# EAGLE design M401M (EAGLE 6.6.0)
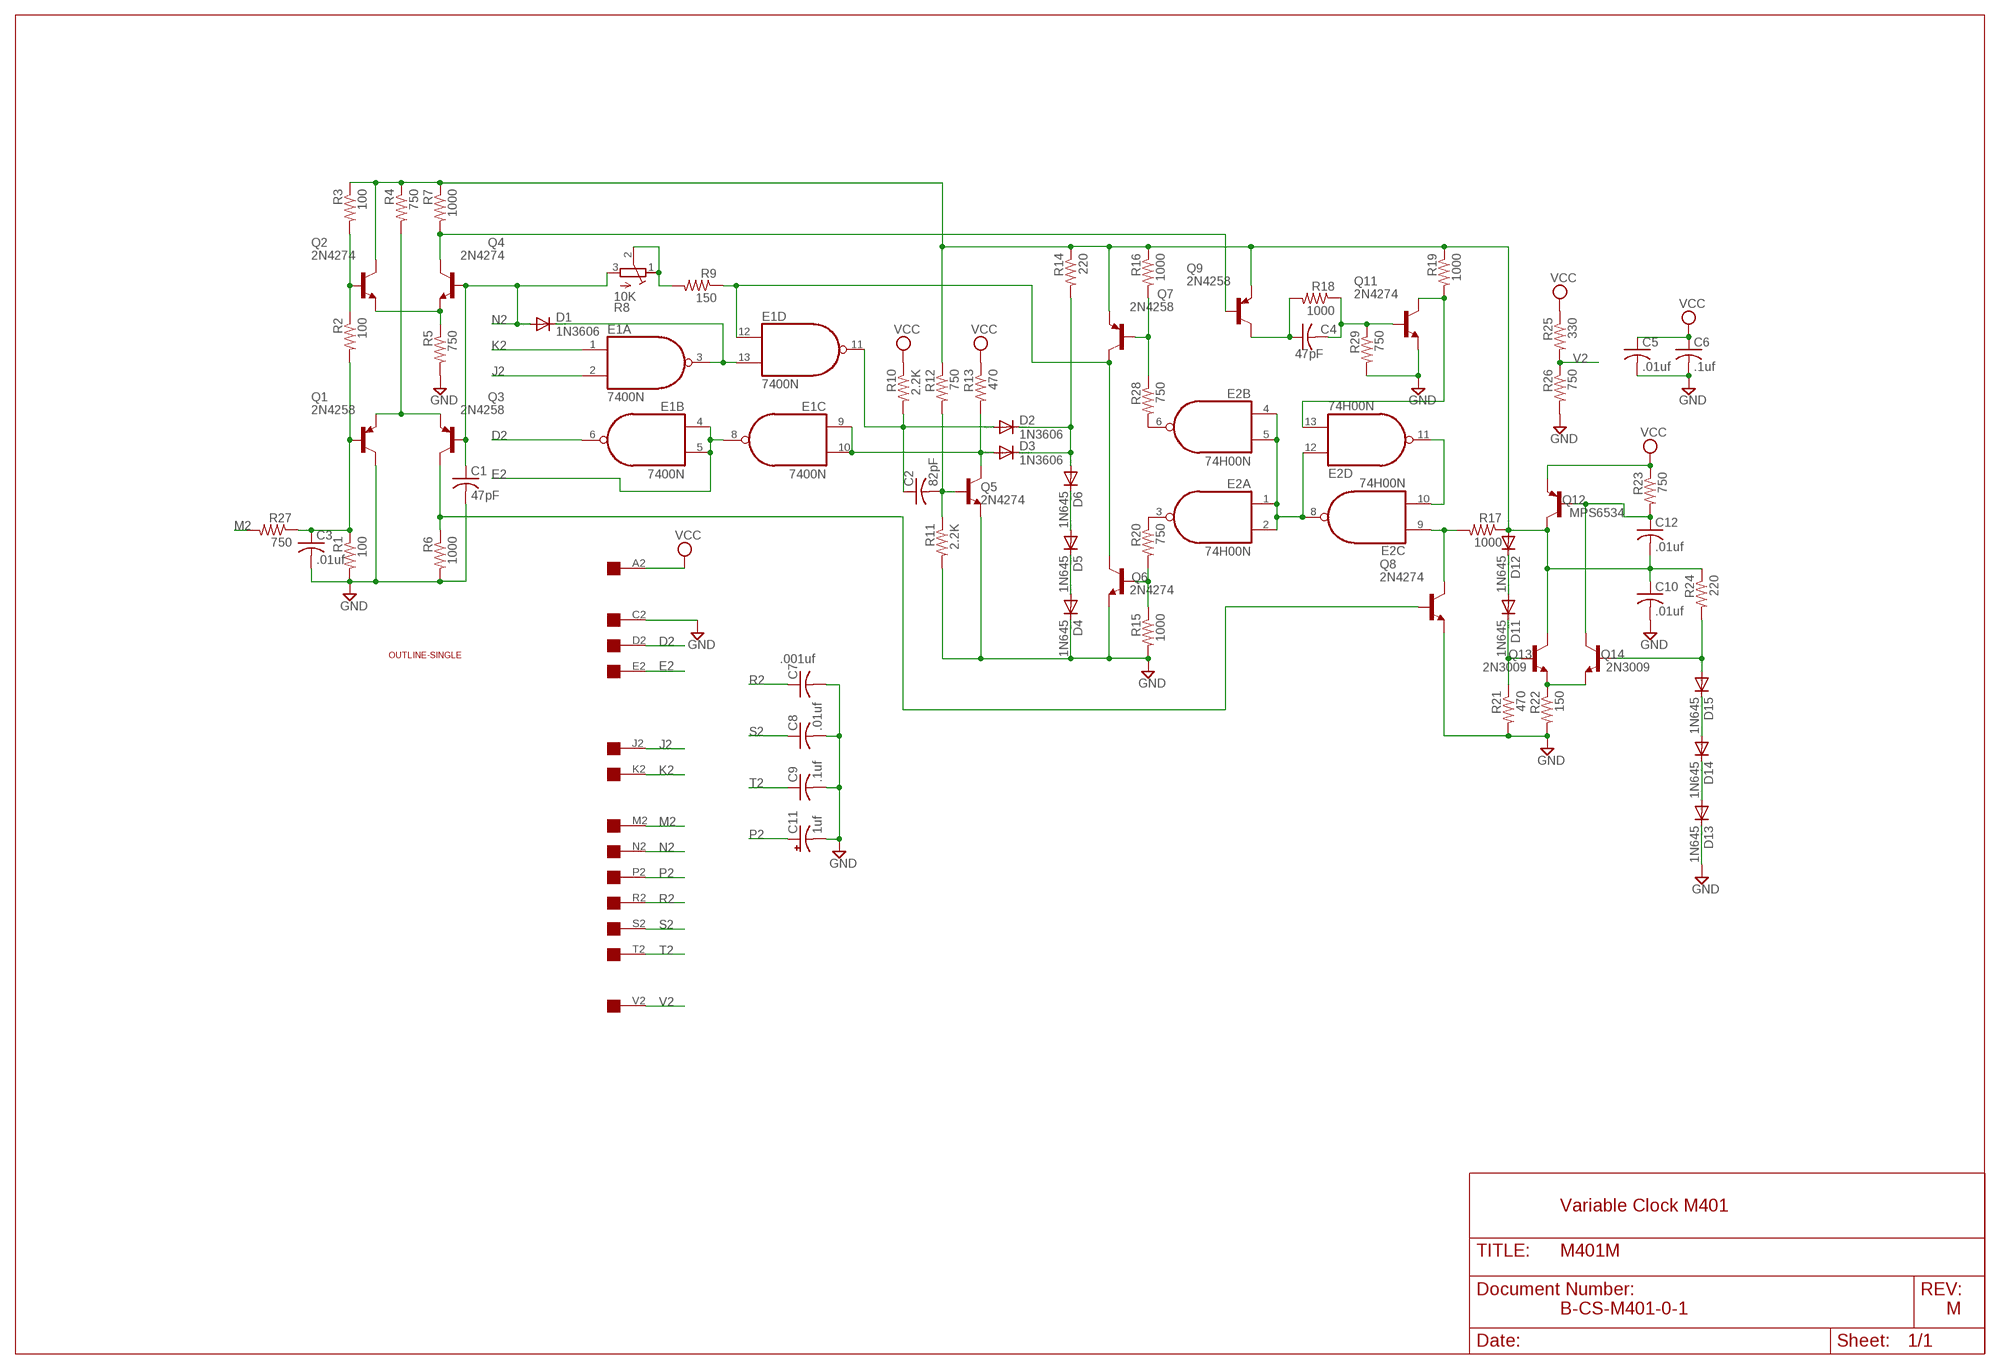
[diagram p0: schematic, sheet 1]

## Parts
C1  47pF  C-US050-025X075  [C050-025X075]
C2  82pF  C-US050-025X075  [C050-025X075]
C3  .01uf  C-US050-025X075  [C050-025X075]
C4  47pF  C-US050-025X075  [C050-025X075]
C5  .01uf  C-US050-025X075  [C050-025X075]
C6  .1uf  C-US102-043X133  [C102-043X133]
C7  .001uf  C-US050-025X075  [C050-025X075]
C8  .01uf  C-US225-062X268  [C225-062X268]
C9  .1uf  C-US275-093X316  [C275-093X316]
C10  .01uf  C-US050-025X075  [C050-025X075]
C11  1uf  CPOL-USE15-5AXIAL  [E15-5]
C12  .01uf  C-US050-025X075  [C050-025X075]
D1  1N3606  1N4148DO35-10  [DO35-10]
D2  1N3606  1N4148DO35-10  [DO35-10]
D3  1N3606  1N4148DO35-10  [DO35-10]
D4  1N645  1N4148DO35-10  [DO35-10]
D5  1N645  1N4148DO35-10  [DO35-10]
D6  1N645  1N4148DO35-10  [DO35-10]
D11  1N645  1N4148DO35-10  [DO35-10]
D12  1N645  1N4148DO35-10  [DO35-10]
D13  1N645  1N4148DO35-10  [DO35-10]
D14  1N645  1N4148DO35-10  [DO35-10]
D15  1N645  1N4148DO35-10  [DO35-10]
E1  7400N  [DIL14]
E2  74H00N  7400N  [DIL14]
Q1  2N4258  2N3637-PNP-TO39-EBC  [TO39]
Q2  2N4274  2N3019-NPN-TO39-EBC  [TO39]
Q3  2N4258  2N3637-PNP-TO39-EBC  [TO39]
Q4  2N4274  2N3019-NPN-TO39-EBC  [TO39]
Q5  2N4274  2N3019-NPN-TO39-EBC  [TO39]
Q6  2N4274  2N3019-NPN-TO39-EBC  [TO39]
Q7  2N4258  2N3637-PNP-TO39-EBC  [TO39]
Q8  2N4274  2N3019-NPN-TO39-EBC  [TO39]
Q9  2N4258  2N3637-PNP-TO39-EBC  [TO39]
Q11  2N4274  2N3019-NPN-TO39-EBC  [TO39]
Q12  MPS6534  2N3637-PNP-TO39-EBC  [TO39]
Q13  2N3009  2N3019-NPN-TO39-EBC  [TO39]
Q14  2N3009  2N3019-NPN-TO39-EBC  [TO39]
R1  100  R-US_0207/10  [0207/10]
R2  100  R-US_0207/10  [0207/10]
R3  100  R-US_0207/10  [0207/10]
R4  750  R-US_0207/10  [0207/10]
R5  750  R-US_0207/10  [0207/10]
R6  1000  R-US_0207/10  [0207/10]
R7  1000  R-US_0207/10  [0207/10]
R8  10K  275P  [3006Y]
R9  150  R-US_0207/10  [0207/10]
R10  2.2K  R-US_0207/10  [0207/10]
R11  2.2K  R-US_0207/10  [0207/10]
R12  750  R-US_0207/10  [0207/10]
R13  470  R-US_0207/10  [0207/10]
R14  220  R-US_0207/10  [0207/10]
R15  1000  R-US_0207/10  [0207/10]
R16  1000  R-US_0207/10  [0207/10]
R17  1000  R-US_0207/10  [0207/10]
R18  1000  R-US_0207/10  [0207/10]
R19  1000  R-US_0207/10  [0207/10]
R20  750  R-US_0207/10  [0207/10]
R21  470  R-US_0207/10  [0207/10]
R22  150  R-US_0207/10  [0207/10]
R23  750  R-US_0207/10  [0207/10]
R24  220  R-US_0207/10  [0207/10]
R25  330  R-US_0207/10  [0207/10]
R26  750  R-US_0207/10  [0207/10]
R27  750  R-US_0207/10  [0207/10]
R28  750  R-US_0207/10  [0207/10]
R29  750  R-US_0207/10  [0207/10]
U$1  OUTLINE-SINGLE  [SINGLE]
U$2  EDGE-1  [EDGE-CON1]

## Nets
D2: E1.6(B:O) U$2.D2
E2: E1.4(B:I0) E1.5(B:I1) E1.8(C:O) U$2.E2
GND [power]: C1.2 C3.2 C5.2 C6.2 C7.2 C8.2 C9.2 C10.2 C11.- D4.C D13.C Q1.3(C) Q5.1(E) Q6.1(E) Q8.1(E) Q11.1(E) R1.2 R5.2 R6.2 R11.2 R15.2 R21.2 R22.2 R26.2 R29.2 U$2.C2
J2: E1.2(A:I1) U$2.J2
K2: E1.1(A:I0) U$2.K2
M2: R27.2 U$2.M2
N2: C1.1 D1.A Q3.2(B) Q4.2(B) R8.3(E) U$2.N2
N$1: D14.A D15.C
N$2: D13.A D14.C
N$3: D15.A Q14.2(B) R24.2
N$4: C12.1 Q12.2(B) Q14.3(C) R23.2
N$5: C10.1 C12.2 D12.A Q2.3(C) Q7.1(E) Q9.1(E) Q12.3(C) Q13.3(C) R3.1 R4.1 R7.1 R12.1 R14.1 R16.1 R17.1 R19.1 R24.1
N$6: D11.C Q13.2(B) R21.1
N$7: Q13.1(E) Q14.1(E) R22.1
N$8: D11.A D12.C
N$9: E2.1(A:I0) E2.2(A:I1) E2.4(B:I0) E2.5(B:I1) E2.8(C:O) E2.12(D:I0)
N$10: C3.1 Q1.2(B) R1.1 R2.2 R27.1
N$11: D3.A E1.9(C:I0) E1.10(C:I1) Q5.3(C) R13.2
N$12: D1.C E1.3(A:O) E1.13(D:I1)
N$13: D4.A D5.C
N$14: E2.10(C:I1) E2.11(D:O)
N$15: E2.9(C:I0) Q8.3(C) R17.2
N$16: E2.3(A:O) R20.1
N$17: E2.6(B:O) R28.2
N$18: Q7.2(B) R16.2 R28.1
N$19: Q6.2(B) R15.1 R20.2
N$20: D5.A D6.C
N$21: E1.12(D:I0) Q6.3(C) Q7.3(C) R9.1
N$22: C4.1 Q9.3(C) R18.2
N$23: C4.2 Q11.2(B) R18.1 R29.1
N$24: E2.13(D:I1) Q11.3(C) R19.2
N$25: D2.C D3.C D6.A R14.2
N$26: R8.1(A) R8.2(S) R9.2
N$28: C2.2 Q5.2(B) R11.1 R12.2
N$29: Q3.3(C) Q8.2(B) R6.1
N$30: C2.1 D2.A E1.11(D:O) R10.2
N$32: Q1.1(E) Q3.1(E) R4.2
N$33: Q4.3(C) Q9.2(B) R7.2
N$34: Q2.2(B) R2.1 R3.2
N$35: Q2.1(E) Q4.1(E) R5.1
P2: C11.+ U$2.P2
R2: C7.1 U$2.R2
S2: C8.1 U$2.S2
T2: C9.1 U$2.T2
V2: R25.2 R26.1 U$2.V2
VCC [power]: C5.1 C6.1 Q12.1(E) R10.1 R13.1 R23.1 R25.1 U$2.A2
Unconnected: U$2.B2 U$2.F2 U$2.H2 U$2.L2 U$2.U2

## Notes on the sheet
- Variable Clock M401
- B-CS-M401-0-1 | M

## Power pins joined to a net without a drawn wire
GND: E1.7(P:GND) E2.7(P:GND)
VCC: E1.14(P:VCC) E2.14(P:VCC)

## Library data of the parts
C1-C10 C12 = rcl:C-US: CAPACITOR, American symbol
C11 = rcl:CPOL-US: POLARIZED CAPACITOR, American symbol
D1-D6 D11-D15 = diode:1N4148: DIODE high speed (Philips)
E1 E2 = 74xx-us:74*00: Quad 2-input NAND gate
Q1 Q3 Q7 Q9 Q12 = transistor:*-PNP-: PNP Transistror
Q2 Q4-Q6 Q8 Q11 Q13 Q14 = transistor:*-NPN-: NPN Transistror BF959 corrected 2008.03.06
R1-R7 R9-R29 = rcl:R-US_: RESISTOR, American symbol
R8 = dec-con:275P: Trimpot with 275P (3006Y) footprint.
U$1 = dec-con:OUTLINE-*: Board outlines for DEC boards.
U$2 = dec-con:EDGE-1: Single-Sided DEC Edge Connector -- (side 2)

## Net classes
1 power: width 0.813 mm

## Board
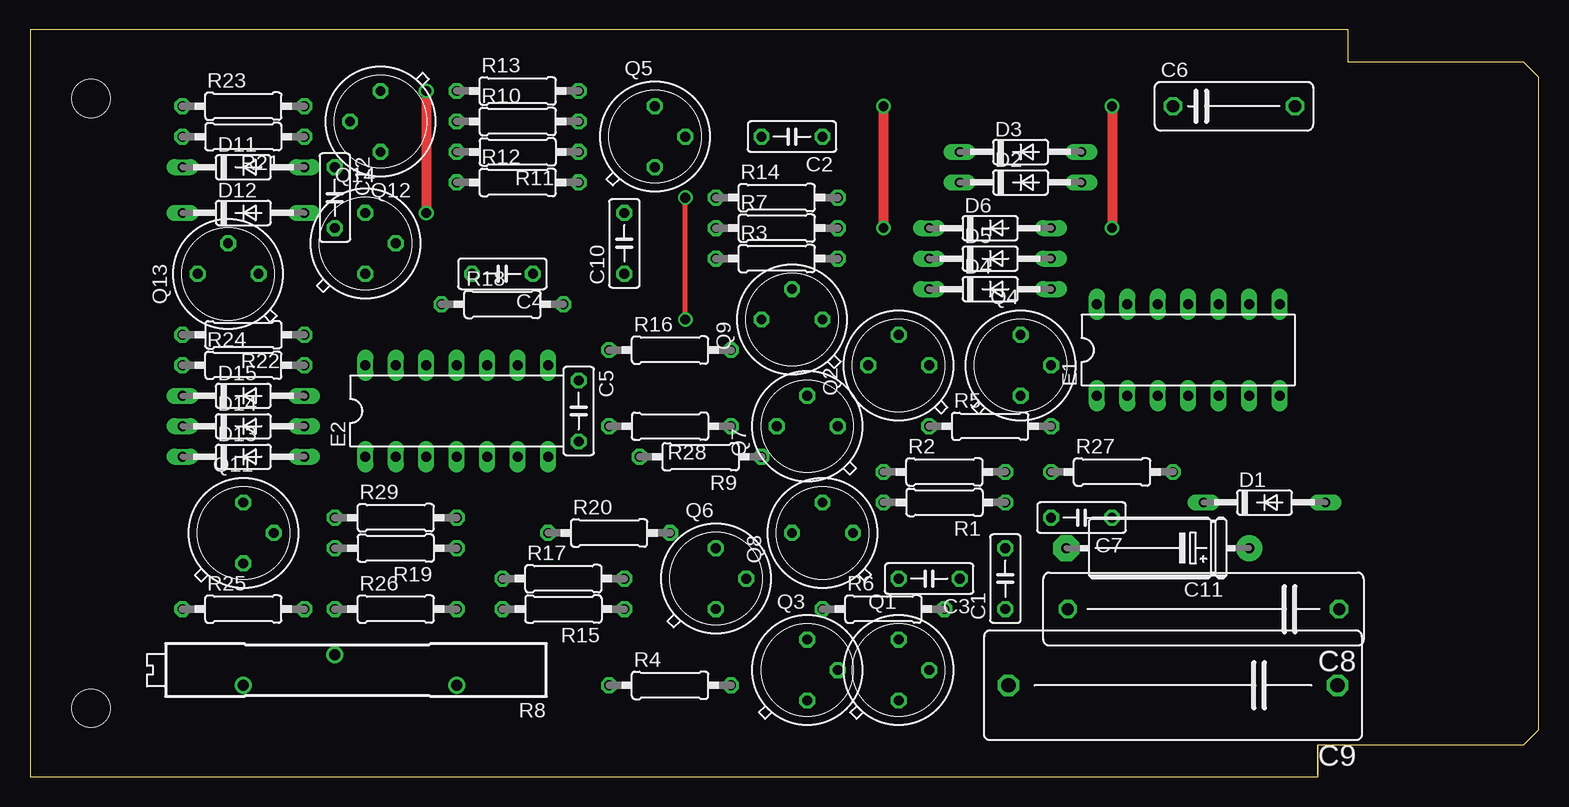
[diagram p1: board, top side]
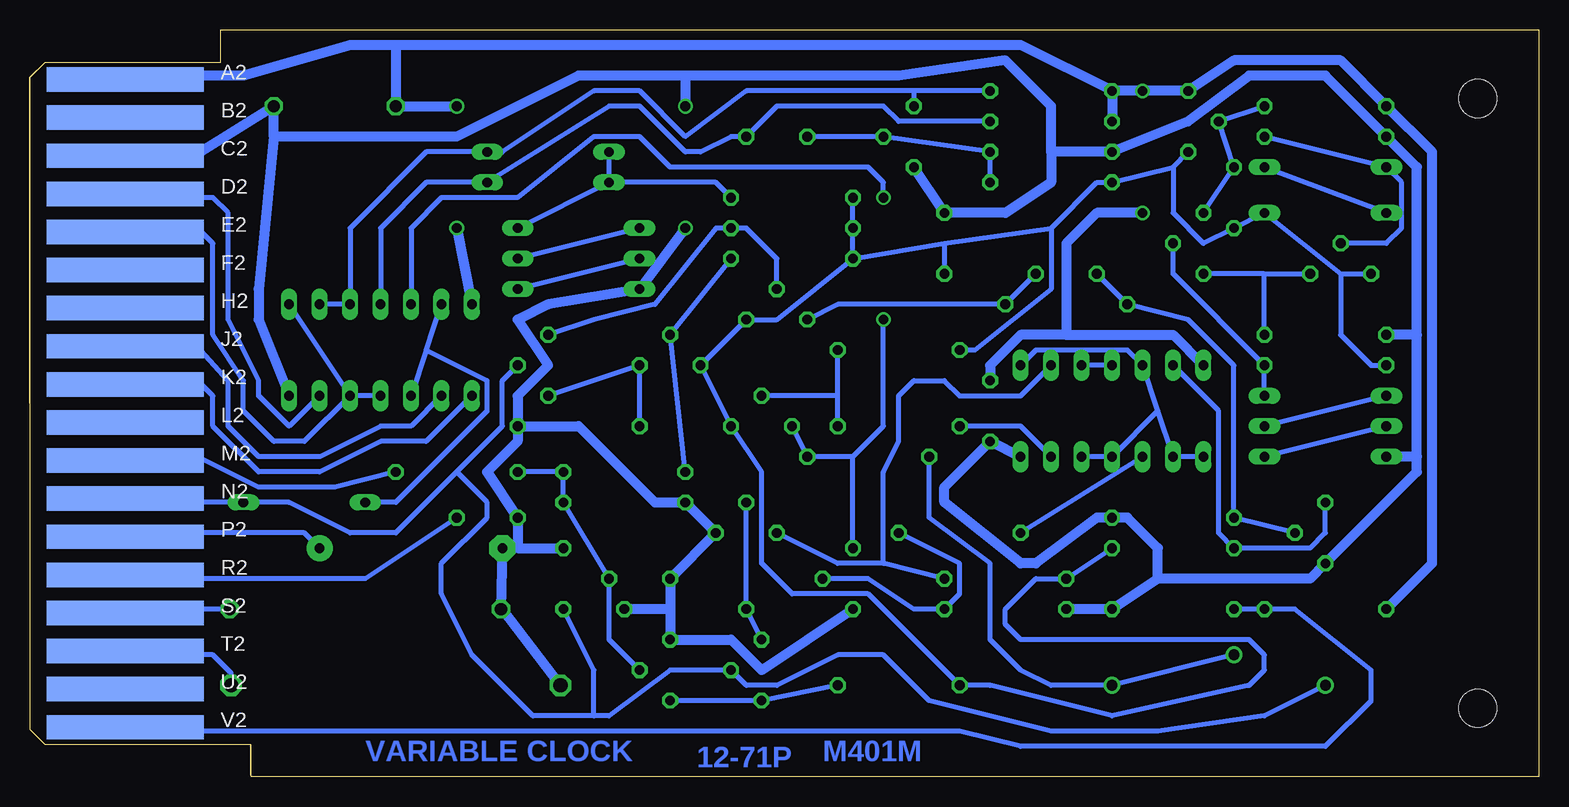
[diagram p2: board, bottom side, seen from below]

Size 125.73 x 62.23 mm. Coordinates in mm from the lower left corner, seen from the top.
Copper layers (1+16): Top 0.035mm / dielectric 1.5mm / Bottom 0.035mm
Design rules "16mils": minimum track width 16mil, minimum drill 32mil, track to track 15mil, track to pad 10mil, pad to pad 10mil, via to via 10mil, smd to smd 10mil, copper to edge 13mil, drill to drill 10mil, minimum pad ring 10mil, minimum via ring 8mil, stop-mask expansion 0mil, vias tented up to drill 0mil, thermal gap 10mil

### Footprints (pad centres in the part's own frame; a part is rotated, then mirrored left to right if it is on the bottom)
C050-025X075 = drill 0.813 octagon: 1 -2.54,0; 2 2.54,0
C102-043X133 = drill 1.016 octagon: 1 -5.08,0; 2 5.08,0
C225-062X268 = drill 1.016 octagon: 1 -11.303,0; 2 11.303,0
C275-093X316 = drill 1.194 octagon: 1 -13.716,0; 2 13.716,0
E15-5 = drill 0.813 pad 2.159: + -7.62,0 | drill 0.813 pad 2.159 octagon: - 7.62,0
DO35-10 = drill 0.813 long: A 5.08,0; C -5.08,0
DIL14 = drill 0.813 long: 1 -7.62,-3.81; 2 -5.08,-3.81; 3 -2.54,-3.81; 4 0,-3.81; 5 2.54,-3.81; 6 5.08,-3.81; 7 7.62,-3.81; 8 7.62,3.81; 9 5.08,3.81; 10 2.54,3.81; 11 0,3.81; 12 -2.54,3.81; 13 -5.08,3.81; 14 -7.62,3.81
TO39 = drill 0.813 octagon: 1 0,-2.54; 2 2.54,0; 3 0,2.54
0207/10 = drill 0.813 octagon: 1 -5.08,0; 2 5.08,0
3006Y = drill 0.9: 1 -8.89,1.27; 2 1.27,-1.27; 3 8.89,1.27
SINGLE = hole 3.175: 120.65,56.515; 120.65,5.715
EDGE-CON1 = smd 13.106 x 2.032 bottom: A2 7.938,4.128; B2 7.938,7.303; C2 7.938,10.477; D2 7.938,13.652; E2 7.938,16.828; F2 7.938,20.003; H2 7.938,23.177; J2 7.938,26.352; K2 7.938,29.527; L2 7.938,32.703; M2 7.938,35.877; N2 7.938,39.053; P2 7.938,42.227; R2 7.938,45.403; S2 7.938,48.578; T2 7.938,51.752; U2 7.938,54.928; V2 7.938,58.102

### Placement (x,y rotation side)
C1  81.28,16.51 90 top
C2  63.5,53.34 180 top
C3  74.93,16.51 180 top
C4  39.37,41.91 180 top
C5  45.72,30.48 270 top
C6  100.33,55.88 0 top
C7  87.63,21.59 180 top
C8  97.79,13.97 180 top
C9  95.25,7.62 180 top
C10  49.53,44.45 90 top
C11  93.98,19.05 180 top
C12  25.4,48.26 270 top
D1  102.87,22.86 0 top
D2  82.55,49.53 0 top
D3  82.55,52.07 0 top
D4  80.01,40.64 0 top
D5  80.01,43.18 0 top
D6  80.01,45.72 0 top
D11  17.78,50.8 0 top
D12  17.78,46.99 0 top
D13  17.78,26.67 0 top
D14  17.78,29.21 0 top
D15  17.78,31.75 0 top
E1  96.52,35.56 0 top
E2  35.56,30.48 0 top
Q1  72.39,8.89 0 top
Q2  72.39,34.29 90 top
Q3  64.77,8.89 0 top
Q4  82.55,34.29 0 top
Q5  52.07,53.34 0 top
Q6  57.15,16.51 0 top
Q7  64.77,29.21 90 top
Q8  66.04,20.32 90 top
Q9  63.5,38.1 90 top
Q11  17.78,20.32 0 top
Q12  29.21,54.61 180 top
Q13  16.51,41.91 90 top
Q14  27.94,44.45 0 top
R1  76.2,22.86 180 top
R2  76.2,25.4 0 top
R3  62.23,43.18 0 top
R4  53.34,7.62 0 top
R5  80.01,29.21 0 top
R6  71.12,13.97 0 top
R7  62.23,45.72 0 top
R8  26.67,8.89 180 top
R9  55.88,26.67 180 top
R10  40.64,54.61 0 top
R11  40.64,52.07 180 top
R12  40.64,49.53 0 top
R13  40.64,57.15 0 top
R14  62.23,48.26 0 top
R15  44.45,13.97 180 top
R16  53.34,35.56 0 top
R17  44.45,16.51 0 top
R18  39.37,39.37 0 top
R19  30.48,19.05 180 top
R20  48.26,20.32 0 top
R21  17.78,53.34 180 top
R22  17.78,36.83 180 top
R23  17.78,55.88 0 top
R24  17.78,34.29 0 top
R25  17.78,13.97 0 top
R26  30.48,13.97 0 top
R27  90.17,25.4 0 top
R28  53.34,29.21 180 top
R29  30.48,21.59 0 top
U$1  125.73,62.23 180 top
U$2  125.73,62.23 180 top

### Tracks (layer width: path | path; a pad name or v marks a point on that pad's centre or on a via)
D2
  Bottom 0.406: E1.6 104.14,29.21 106.68,31.75 106.68,33.02 109.22,38.1 109.22,46.99 110.49,48.26 115.57,48.26 U$2.D2
E2
  Bottom 0.406: E1.5 E1.8 | E1.4 E1.5 | U$2.E2 116.84,45.72 111.76,45.72 110.49,44.45 110.49,36.83 107.95,33.02 107.95,30.48 105.41,27.94 102.87,27.94 E1.5
GND  (via drill 0.81)
  Top 0.813: v71.12,55.88 v71.12,45.72
  Bottom 0.813: U$2.C2 116.84,52.07 111.51,52.07 C6.2 105.41,53.34 | 105.41,53.34 106.68,40.64 106.68,38.1 E1.7 | 105.41,53.34 90.17,53.34 80.01,58.42 71.12,58.42 | 71.12,58.42 v71.12,55.88 | v71.12,45.72 D4.C 82.55,39.37 85.09,38.1 82.55,34.29 85.09,31.75 R5.2 | 71.12,58.42 53.34,58.42 44.45,59.69 40.64,55.88 40.64,52.07 | 40.64,52.07 R11.2 29.21,54.61 24.13,58.42 17.78,58.42 R21.2 10.16,50.8 10.16,36.83 | 40.64,52.07 40.64,49.53 44.45,46.99 C10.2 Q5.1 | C9.2 86.36,13.97 C8.2 C11.- 85.09,19.05 | 85.09,19.05 C1.2 | 85.09,19.05 C7.2 87.63,25.4 85.09,27.94 R5.2 | 10.16,26.67 10.16,25.4 Q11.1 19.05,16.51 31.75,16.51 | 10.16,36.83 R22.2 | 10.16,26.67 10.16,36.83 | 10.16,26.67 D13.C | E2.7 C5.2 49.53,24.13 49.53,22.86 43.18,17.78 41.91,17.78 36.83,21.59 R29.2 34.29,21.59 31.75,19.05 31.75,16.51 | 31.75,16.51 R26.2 R15.2 | Q6.1 64.77,8.89 67.31,11.43 Q1.3 72.39,13.97 | 72.39,13.97 C3.2 Q8.1 R1.2 73.66,22.86 80.01,29.21 R5.2 | 72.39,13.97 R6.2
J2
  Bottom 0.406: U$2.J2 116.84,35.56 111.51,35.56 109.22,33.02 109.22,29.21 106.68,26.67 101.6,26.67 96.52,29.21 93.98,29.21 E1.2
K2
  Bottom 0.406: U$2.K2 116.84,33.02 111.76,33.02 110.49,31.75 110.49,29.21 106.68,25.4 101.6,25.4 96.52,27.94 92.71,27.94 E1.1
M2
  Bottom 0.406: U$2.M2 116.84,26.67 111.76,26.67 106.68,24.13 100.33,24.13 R27.2
N2
  Bottom 0.406: U$2.N2 115.57,22.86 D1.A 104.14,22.86 99.06,20.32 95.25,20.32 90.17,25.4 | R8.3 22.86,5.08 31.75,3.81 40.64,3.81 50.8,6.35 54.61,10.16 58.42,10.16 63.5,7.62 66.04,7.62 Q3.2 72.39,8.89 77.47,5.08 78.74,5.08 | 78.74,5.08 78.74,8.89 C1.1 | 78.74,5.08 83.82,5.08 88.9,10.16 91.44,15.24 91.44,17.78 87.63,21.59 87.63,22.86 90.17,25.4 | Q4.2 86.36,33.02 86.36,29.21 90.17,25.4
N$1
  Bottom 0.406: D15.C D14.A
N$2
  Bottom 0.406: D14.C D13.A
N$3
  Bottom 0.406: D15.A R24.2 30.48,41.91 Q14.2
N$4
  Bottom 0.406: Q14.3 C12.1 Q12.2 R23.2
N$5
  Bottom 0.406: 30.48,50.8 R12.1 36.83,49.53 40.64,45.72 | R19.1 R17.1 41.91,16.51 44.45,13.97 44.45,12.7 43.18,11.43 24.13,11.43 22.86,10.16 22.86,8.89 24.13,7.62 35.56,5.08 45.72,7.62 R4.1 55.88,15.24 62.23,15.24 64.77,17.78 64.77,25.4 Q7.1 Q2.3 Q9.1 63.5,38.1 R3.1 | R3.1 49.53,44.45 | 49.53,44.45 C10.1 | 49.53,44.45 40.64,45.72 | 30.48,50.8 30.48,46.99 27.94,44.45 C12.2 D12.A 16.51,41.91 | 30.48,50.8 Q12.3 | R24.1 13.97,34.29 16.51,36.83 16.51,41.91 | 16.51,41.91 Q13.3 | R14.1 R7.1 R3.1 | R16.1 46.99,35.56 40.64,40.64 40.64,45.72
N$6
  Bottom 0.406: Q13.2 12.7,44.45 11.43,45.72 11.43,49.53 D11.C R21.1
N$7
  Bottom 0.406: 22.86,41.91 Q13.1 | 22.86,41.91 Q14.1 | R22.1 22.86,41.91
N$8
  Bottom 0.406: D12.C D11.A
N$9
  Bottom 0.406: 31.75,30.48 E2.2 E2.1 | 31.75,30.48 E2.12 34.29,35.56 41.91,35.56 E2.8 | 31.75,30.48 E2.4 E2.5
N$10
  Bottom 0.406: R1.1 R2.2 | R2.2 R27.1 | R1.1 R2.2 | Q1.2 77.47,11.43 C3.1 R1.1
N$11
  Bottom 0.406: R13.2 52.07,57.15 | 52.07,57.15 Q5.3 | 52.07,57.15 66.04,57.15 71.12,53.34 74.93,57.15 78.74,57.15 86.36,52.07 D3.A 92.71,52.07 99.06,45.72 E1.10 E1.9
N$12
  Bottom 0.406: 92.71,35.56 E1.3 | 92.71,35.56 E1.13 | D1.C 95.25,22.86 87.63,30.48 87.63,33.02 92.71,35.56
N$13
  Bottom 0.406: D5.C D4.A
N$14
  Bottom 0.406: E2.11 E2.10
N$15
  Bottom 0.406: E2.9 43.18,31.75 48.26,31.75 49.53,33.02 52.07,33.02 53.34,31.75 53.34,27.94 54.61,25.4 54.61,17.78 | R17.2 54.61,17.78 | 54.61,17.78 58.42,17.78 Q8.3
N$16
  Bottom 0.406: E2.3 R20.1
N$17
  Bottom 0.406: R28.2 43.18,29.21 E2.6
N$18
  Bottom 0.406: 58.42,31.75 Q7.2 | R28.1 58.42,31.75 | 58.42,31.75 R16.2
N$19
  Bottom 0.406: Q6.2 55.88,16.51 52.07,13.97 R15.1 48.26,15.24 48.26,17.78 R20.2
N$20
  Bottom 0.406: D6.C D5.A
N$21  (via drill 0.81)
  Top 0.406: v54.61,38.1 v54.61,48.26
  Bottom 0.406: E1.12 93.98,45.72 91.44,48.26 85.09,48.26 78.74,53.34 74.93,53.34 72.39,50.8 55.88,50.8 54.61,49.53 v54.61,48.26 | v54.61,38.1 54.61,29.21 57.15,26.67 | 57.15,26.67 R9.1 Q7.3 | Q6.3 57.15,26.67
N$22
  Bottom 0.406: C4.1 R18.2 58.42,39.37 Q9.3
N$23
  Bottom 0.406: Q11.2 R29.1 25.4,34.29 29.21,38.1 R18.1 C4.2
N$24
  Bottom 0.406: Q11.3 17.78,20.32 19.05,19.05 R19.2 26.67,20.32 26.67,30.48 E2.13
N$25
  Bottom 0.406: D2.C D6.A | D2.C D3.C | D2.C 68.58,49.53 R14.2
N$26
  Bottom 0.406: R8.2 R8.1 40.64,7.62 43.18,8.89 45.72,11.43 45.72,17.78 50.8,21.59 R9.2
N$28
  Bottom 0.406: C2.2 Q5.2 R11.1 R12.2
N$29
  Bottom 0.406: Q8.2 R6.1 Q3.3
N$30
  Bottom 0.406: R10.2 53.34,54.61 54.61,55.88 63.5,55.88 C2.1 67.31,53.34 69.85,52.07 71.12,52.07 74.93,55.88 77.47,55.88 D2.A 92.71,49.53 96.52,45.72 E1.11
N$32
  Bottom 0.406: R4.2 Q3.1 Q1.1
N$33
  Bottom 0.406: Q4.3 78.74,38.1 73.66,39.37 68.58,45.72 R7.2 66.04,45.72 63.5,43.18 Q9.2
N$34
  Bottom 0.406: R3.2 Q2.2 R2.1
N$35
  Bottom 0.406: R5.1 Q2.1 Q4.1
P2
  Bottom 0.406: U$2.P2 116.84,20.32 102.87,20.32 C11.+
R2
  Bottom 0.406: U$2.R2 116.84,16.51 97.79,16.51 C7.1
S2
  Bottom 0.406: U$2.S2 116.84,13.97 C8.1
T2
  Bottom 0.406: U$2.T2 116.84,10.16 110.49,10.16 108.97,8.64 C9.1
V2
  Bottom 0.406: U$2.V2 116.84,3.81 48.26,3.81 43.18,2.54 17.78,2.54 13.97,6.35 13.97,8.89 20.32,13.97 R25.2 R26.1
VCC  (via drill 0.81)
  Top 0.813: v90.17,55.88 v90.17,45.72 | v33.02,57.15 v33.02,46.99
  Bottom 0.813: U$2.A2 116.84,58.42 107.95,58.42 99.06,60.96 95.25,60.96 | 95.25,60.96 C6.1 v90.17,55.88 | 95.25,60.96 43.18,60.96 R13.1 | R13.1 v33.02,57.15 Q12.1 25.4,59.69 16.51,59.69 R23.1 8.89,52.07 8.89,17.78 R25.1 | v90.17,45.72 E1.14 | E2.14 30.48,36.83 39.37,36.83 | 39.37,36.83 43.18,36.83 45.72,34.29 C5.1 | R13.1 R10.1 | v33.02,46.99 36.83,46.99 39.37,44.45 39.37,36.83

### Text on the board
Bottom: 12-71P | M401M | VARIABLE CLOCK